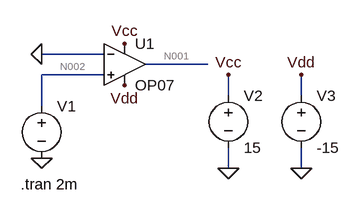
[diagram p0: schematic comparateur.asc]
comparateur.asc, the LTspice schematic file:
Version 4
SHEET 1 880 680
WIRE 112 128 16 128
WIRE 272 144 176 144
WIRE 112 160 16 160
WIRE 304 192 304 160
WIRE 416 192 416 160
WIRE 16 208 16 160
WIRE 304 304 304 272
WIRE 416 304 416 272
FLAG 16 128 0
FLAG 304 304 0
FLAG 416 304 0
FLAG 16 288 0
FLAG 304 160 Vcc
FLAG 144 112 Vcc
FLAG 144 176 Vdd
FLAG 416 160 Vdd
SYMBOL Opamps\\OP07 144 80 R0
SYMATTR InstName U1
SYMBOL voltage 16 192 R0
WINDOW 3 24 96 Invisible 2
WINDOW 123 0 0 Left 0
WINDOW 39 0 0 Left 0
SYMATTR Value PULSE(-5 5 0 1n 1n 0.5m 1m)
SYMATTR InstName V1
SYMBOL voltage 304 176 R0
WINDOW 123 0 0 Left 0
WINDOW 39 0 0 Left 0
SYMATTR InstName V2
SYMATTR Value 15
SYMBOL voltage 416 176 R0
WINDOW 123 0 0 Left 0
WINDOW 39 0 0 Left 0
SYMATTR InstName V3
SYMATTR Value -15
TEXT -16 328 Left 2 !.tran 2m

The netlist it stands for:
* comparateur.asc
XU1 N002 0 Vcc Vdd N001 LT1001  ; OP07, pins In+ In- V+ V- OUT
V1 N002 0 PULSE(-5 5 0 1n 1n 0.5m 1m)
V2 Vcc 0 15
V3 Vdd 0 -15
.tran 2m
.lib LTC.lib
.backanno
.end

* Results of the author's LTspice run, read from the files saved beside the schematic
* Operating Point, zero values left out:
*   V(n002) = -5 V
*   V(vcc) = 15 V
*   V(vdd) = -15 V
*   V(n001) = -14.07 V
*   I(V3) = 2.247 mA
*   I(V2) = -2.254 mA
*   I(V1) = 3.044 mA
*   Ix(u1:1) = -3.044 mA
*   Ix(u1:2) = 3.044 mA
*   Ix(u1:3) = 2.254 mA
*   Ix(u1:4) = -2.247 mA
*   Ix(u1:5) = 28.14 pA
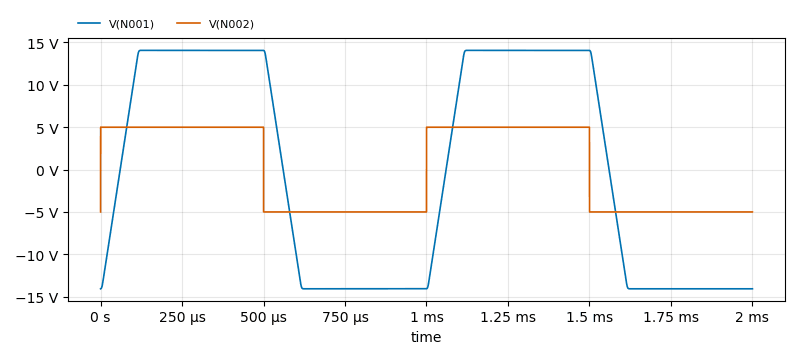
[diagram p1: Transient Analysis of comparateur.asc, plotted from the saved traces]
* Transient Analysis, 1 run:
*   V(N001): min -14.07 V, max 14.07 V, average 28.18 µV, rms 13.19 V, last -14.07 V
*   V(N002): min -5 V, max 5 V, average 10 µV, rms 5 V, last -5 V